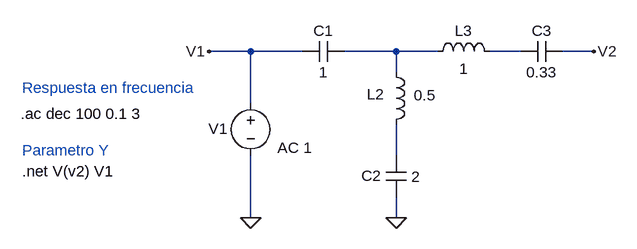
[diagram p0: schematic EJ1.asc]
EJ1.asc, the LTspice schematic file:
Version 4
SHEET 1 880 680
WIRE -48 96 -112 96
WIRE 32 96 -48 96
WIRE 176 96 96 96
WIRE 240 96 176 96
WIRE 368 96 320 96
WIRE 480 96 432 96
WIRE 176 128 176 96
WIRE -48 176 -48 96
WIRE 176 256 176 208
WIRE -48 352 -48 256
WIRE 176 352 176 320
FLAG 176 352 0
FLAG -48 352 0
FLAG 480 96 V2
FLAG -112 96 V1
SYMBOL cap 96 80 R90
WINDOW 0 0 32 VBottom 2
WINDOW 3 32 32 VTop 2
SYMATTR InstName C1
SYMATTR Value 1
SYMBOL cap 192 320 R180
WINDOW 0 39 33 Left 2
WINDOW 3 -21 31 Left 2
SYMATTR InstName C2
SYMATTR Value 2
SYMBOL ind 160 112 R0
WINDOW 0 -29 50 Left 2
WINDOW 3 43 51 Left 2
SYMATTR InstName L2
SYMATTR Value 0.5
SYMBOL cap 432 80 R90
WINDOW 0 0 32 VBottom 2
WINDOW 3 32 32 VTop 2
SYMATTR InstName C3
SYMATTR Value 0.33
SYMBOL ind 224 112 R270
WINDOW 0 32 56 VTop 2
WINDOW 3 5 56 VBottom 2
SYMATTR InstName L3
SYMATTR Value 1
SYMBOL voltage -48 160 R0
WINDOW 0 -65 55 Left 2
WINDOW 3 41 56 Left 2
WINDOW 123 41 84 Left 2
WINDOW 39 0 0 Left 0
SYMATTR InstName V1
SYMATTR Value ""
SYMATTR Value2 AC 1
TEXT -402 192 Left 2 !.ac dec 100 0.1 3
TEXT -400 280 Left 2 !.net V(v2) V1
TEXT -400 152 Left 2 ;Respuesta en frecuencia
TEXT -400 248 Left 2 ;Parametro Y

The netlist it stands for:
* EJ1.asc
C1 N001 V1 1
C2 0 N003 2
L2 N001 N003 0.5
C3 V2 N002 0.33
L3 N001 N002 1
V1 V1 0 AC 1
.ac dec 100 0.1 3
.net V(v2) V1
* Respuesta en frecuencia
* Parametro Y
.backanno
.end